# Altium schematic sheet MCU.SchDoc
size A3; SheetNumber: 2; SheetTotal: 5
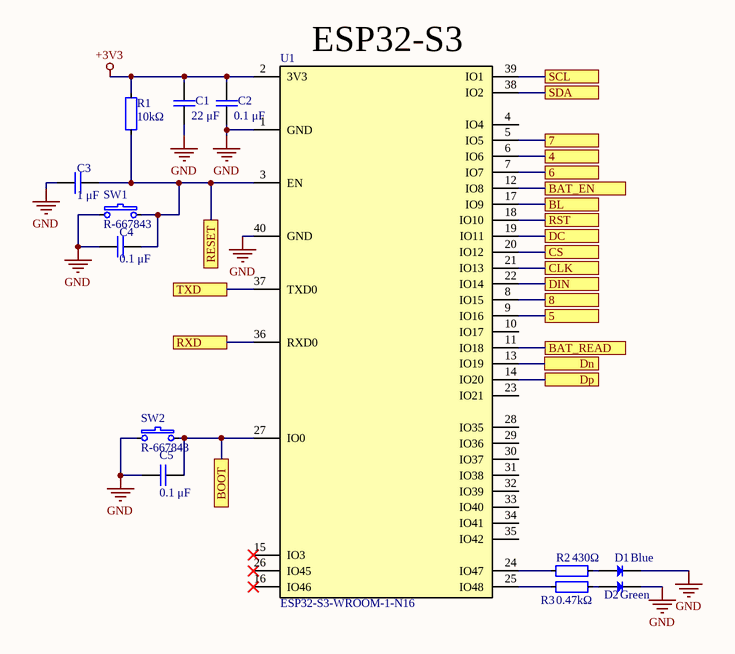
[diagram p0: MCU.SchDoc]

## Parts
C1  22 μF  [Capacitor 0603]
C2  0.1 μF  [Capacitor 0603]
C3  1 μF  [Capacitor 0603]
C4  0.1 μF  [Capacitor 0603]
C5  0.1 μF  [Capacitor 0603]
D1  Blue  [LED 0603]
D2  Green  [LED 0603]
R1  10kΩ  [Resistor 0603]
R2  430Ω  [Resistor 0603]
R3  0.47kΩ  [Resistor 0603]
SW1  R-667843  [R-667843]
SW2  R-667843  [R-667843]
U1  ESP32-S3-WROOM-1-N16  [ESP32-C3-WROOM-1]

## Ports
4 (see Main[5B], Peripherals[3C]), 5 (see Main[5B], Peripherals[4C]), 6 (see Main[5B], Peripherals[5C]), 7 (see Main[5B], Peripherals[4C]), 8 (see Main[5B], Peripherals[3C]), BAT_EN (see Main[4B], Power[5C]), BAT_READ (see Main[4B], Power[5C]), BL (see Main[5A], Peripherals[6B]), BOOT (see Main[4B], COM[8B]), CLK (see Main[5B], Peripherals[6B]), CS (see Main[5B], Peripherals[6B]), DC (see Main[5B], Peripherals[6B]), DIN (see Main[5A], Peripherals[6B]), Dn (see Main[4B], COM[5C]), Dp (see Main[4B], COM[5C]), RESET (see Main[4A], COM[8B]), RST (see Main[5B], Peripherals[6B]), RXD (see Main[4B], COM[6B]), SCL (see Main[5A], Peripherals[2B]), SDA (see Main[5A], Peripherals[2B]), TXD (see Main[4B], COM[6B])

## Nets
+3V3: C1.B C2.B R1.A U1.2(3V3)
GND: C1.A C2.A C3.A C4.A C5.B D1.B D2.B SW1.A SW2.B U1.1(GND) U1.40(GND)
4: U1.6(IO6) ; port 4
5: U1.9(IO16) ; port 5
6: U1.7(IO7) ; port 6
7: U1.5(IO5) ; port 7
8: U1.8(IO15) ; port 8
BAT_EN: U1.12(IO8) ; port BAT_EN
BAT_READ: U1.11(IO18) ; port BAT_READ
BL: U1.17(IO9) ; port BL
BOOT: C5.A SW2.A U1.27(IO0) ; port BOOT
CLK: U1.21(IO13) ; port CLK
CS: U1.20(IO12) ; port CS
DC: U1.19(IO11) ; port DC
DIN: U1.22(IO14) ; port DIN
Dn: U1.13(IO19) ; port Dn
Dp: U1.14(IO20) ; port Dp
RESET: C3.B C4.B R1.B SW1.B U1.3(EN) ; port RESET
RST: U1.18(IO10) ; port RST
RXD: U1.36(RXD0) ; port RXD
SCL: U1.39(IO1) ; port SCL
SDA: U1.38(IO2) ; port SDA
TXD: U1.37(TXD0) ; port TXD
NetD1_A: D1.A R2.B
NetD2_A: D2.A R3.B
NetR2_A: R2.A U1.24(IO47)
NetR3_A: R3.A U1.25(IO48)

Not connected (* = marked no-connect by the designer): U1 4(IO4) 10(IO17) 15(IO3)* 16(IO46)* 23(IO21) 26(IO45)* 28(IO35) 29(IO36) 30(IO37) 31(IO38) 32(IO39) 33(IO40) 34(IO41) 35(IO42)

## Notes on the sheet
- (near U1) ESP32-S3

## Library data of the parts
C1 = 22 μF 0603: Capacitor 22 μF; Manufacturer: Murata Electronics; Manufacturer Part Number: GRM188R60G226MEA0D; Supplier 1: Digikey; Supplier Part Number 1: 490-5526-1-ND; Value: 22 μF
C2 C4 C5 = 0.1 μF 0603: Capacitor 0.1 μF; Manufacturer: Samsung Electro-Mechanics; Manufacturer Part Number: CL10B104KB8NNWC; Supplier 1: Digikey; Supplier Part Number 1: 1276-1935-1-ND; Value: 0.1 μF
C3 = 1 μF 0603: Capacitor 1 μF; Manufacturer: Samsung Electro-Mechanics; Manufacturer Part Number: CL10A105KA8NNNC; Supplier 1: Digikey; Supplier Part Number 1: 1276-1102-1-ND; Value: 1 μF
D1 = D.Blue: Diode Blue; Manufacturer: Lite-On Inc.; Manufacturer Part Number: LTST-C193TBKT-5A; Supplier 1: Digikey; Supplier Part Number 1: 160-1827-1-ND; Value: Blue
D2 = D.Green: Diode Green; Manufacturer: Lumex Opto/Components Inc.; Manufacturer Part Number: SML-LXFT0603GC-TR; Supplier 1: Digikey; Supplier Part Number 1: 67-SML-LXFT0603GC-TRCT-ND; Value: Green
R1 = 10 kΩ 0603: Resistor 10000 Ω; Manufacturer: Stackpole Electronics Inc; Manufacturer Part Number: RMCF0603FT10K0; Supplier 1: Digikey; Supplier Part Number 1: RMCF0603FT10K0CT-ND; Value: 10kΩ
R2 = 430 Ω 0603: Resistor 430 Ω; Manufacturer: Stackpole Electronics Inc; Manufacturer Part Number: RMCF0603JT430R; Supplier 1: Digikey; Supplier Part Number 1: RMCF0603JT430RCT-ND; Value: 430Ω
R3 = 0.47 kΩ 0603: Resistor 470 Ω; Manufacturer: Stackpole Electronics Inc; Manufacturer Part Number: RMCF0603FT470R; Supplier 1: Digikey; Supplier Part Number 1: RMCF0603FT470RCT-ND; Value: 0.47kΩ
SW1 SW2 = R-667843: SWITCH TACTILE SPST-NO 0.05A 12V; Manufacturer: Mitsumi Electric Company Ltd; Supplier 1: Digikey; Supplier Part Number 1: 2508-R-667843CT-ND; Manufacturer Part Number: R-667843
U1 = ESP32-S3-WROOM-1-N16: RF TXRX MODULE BT PCB TRACE SMD; Manufacturer: Espressif Systems; Supplier 1: Digikey; Supplier Part Number 1: 1965-ESP32-S3-WROOM-1-N16CT-ND; Manufacturer Part Number: ESP32-S3-WROOM-1-N16